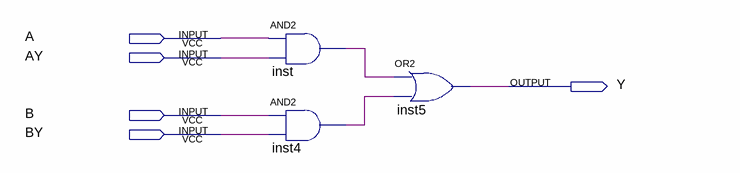
[diagram p0: schematic sheet]
// Quartus schematic dataSelection-2-1.bdf as structural Verilog: 3 symbols, 5 pins
module \dataSelection-2-1  (
  input  A,
  input  AY,
  input  B,
  input  BY,
  output Y
);

  wire inst4_out, inst_out;

  and inst (inst_out, A, AY);
  and inst4 (inst4_out, B, BY);
  or inst5 (Y, inst_out, inst4_out);
endmodule
